# EAGLE design board (EAGLE 7.7.0)
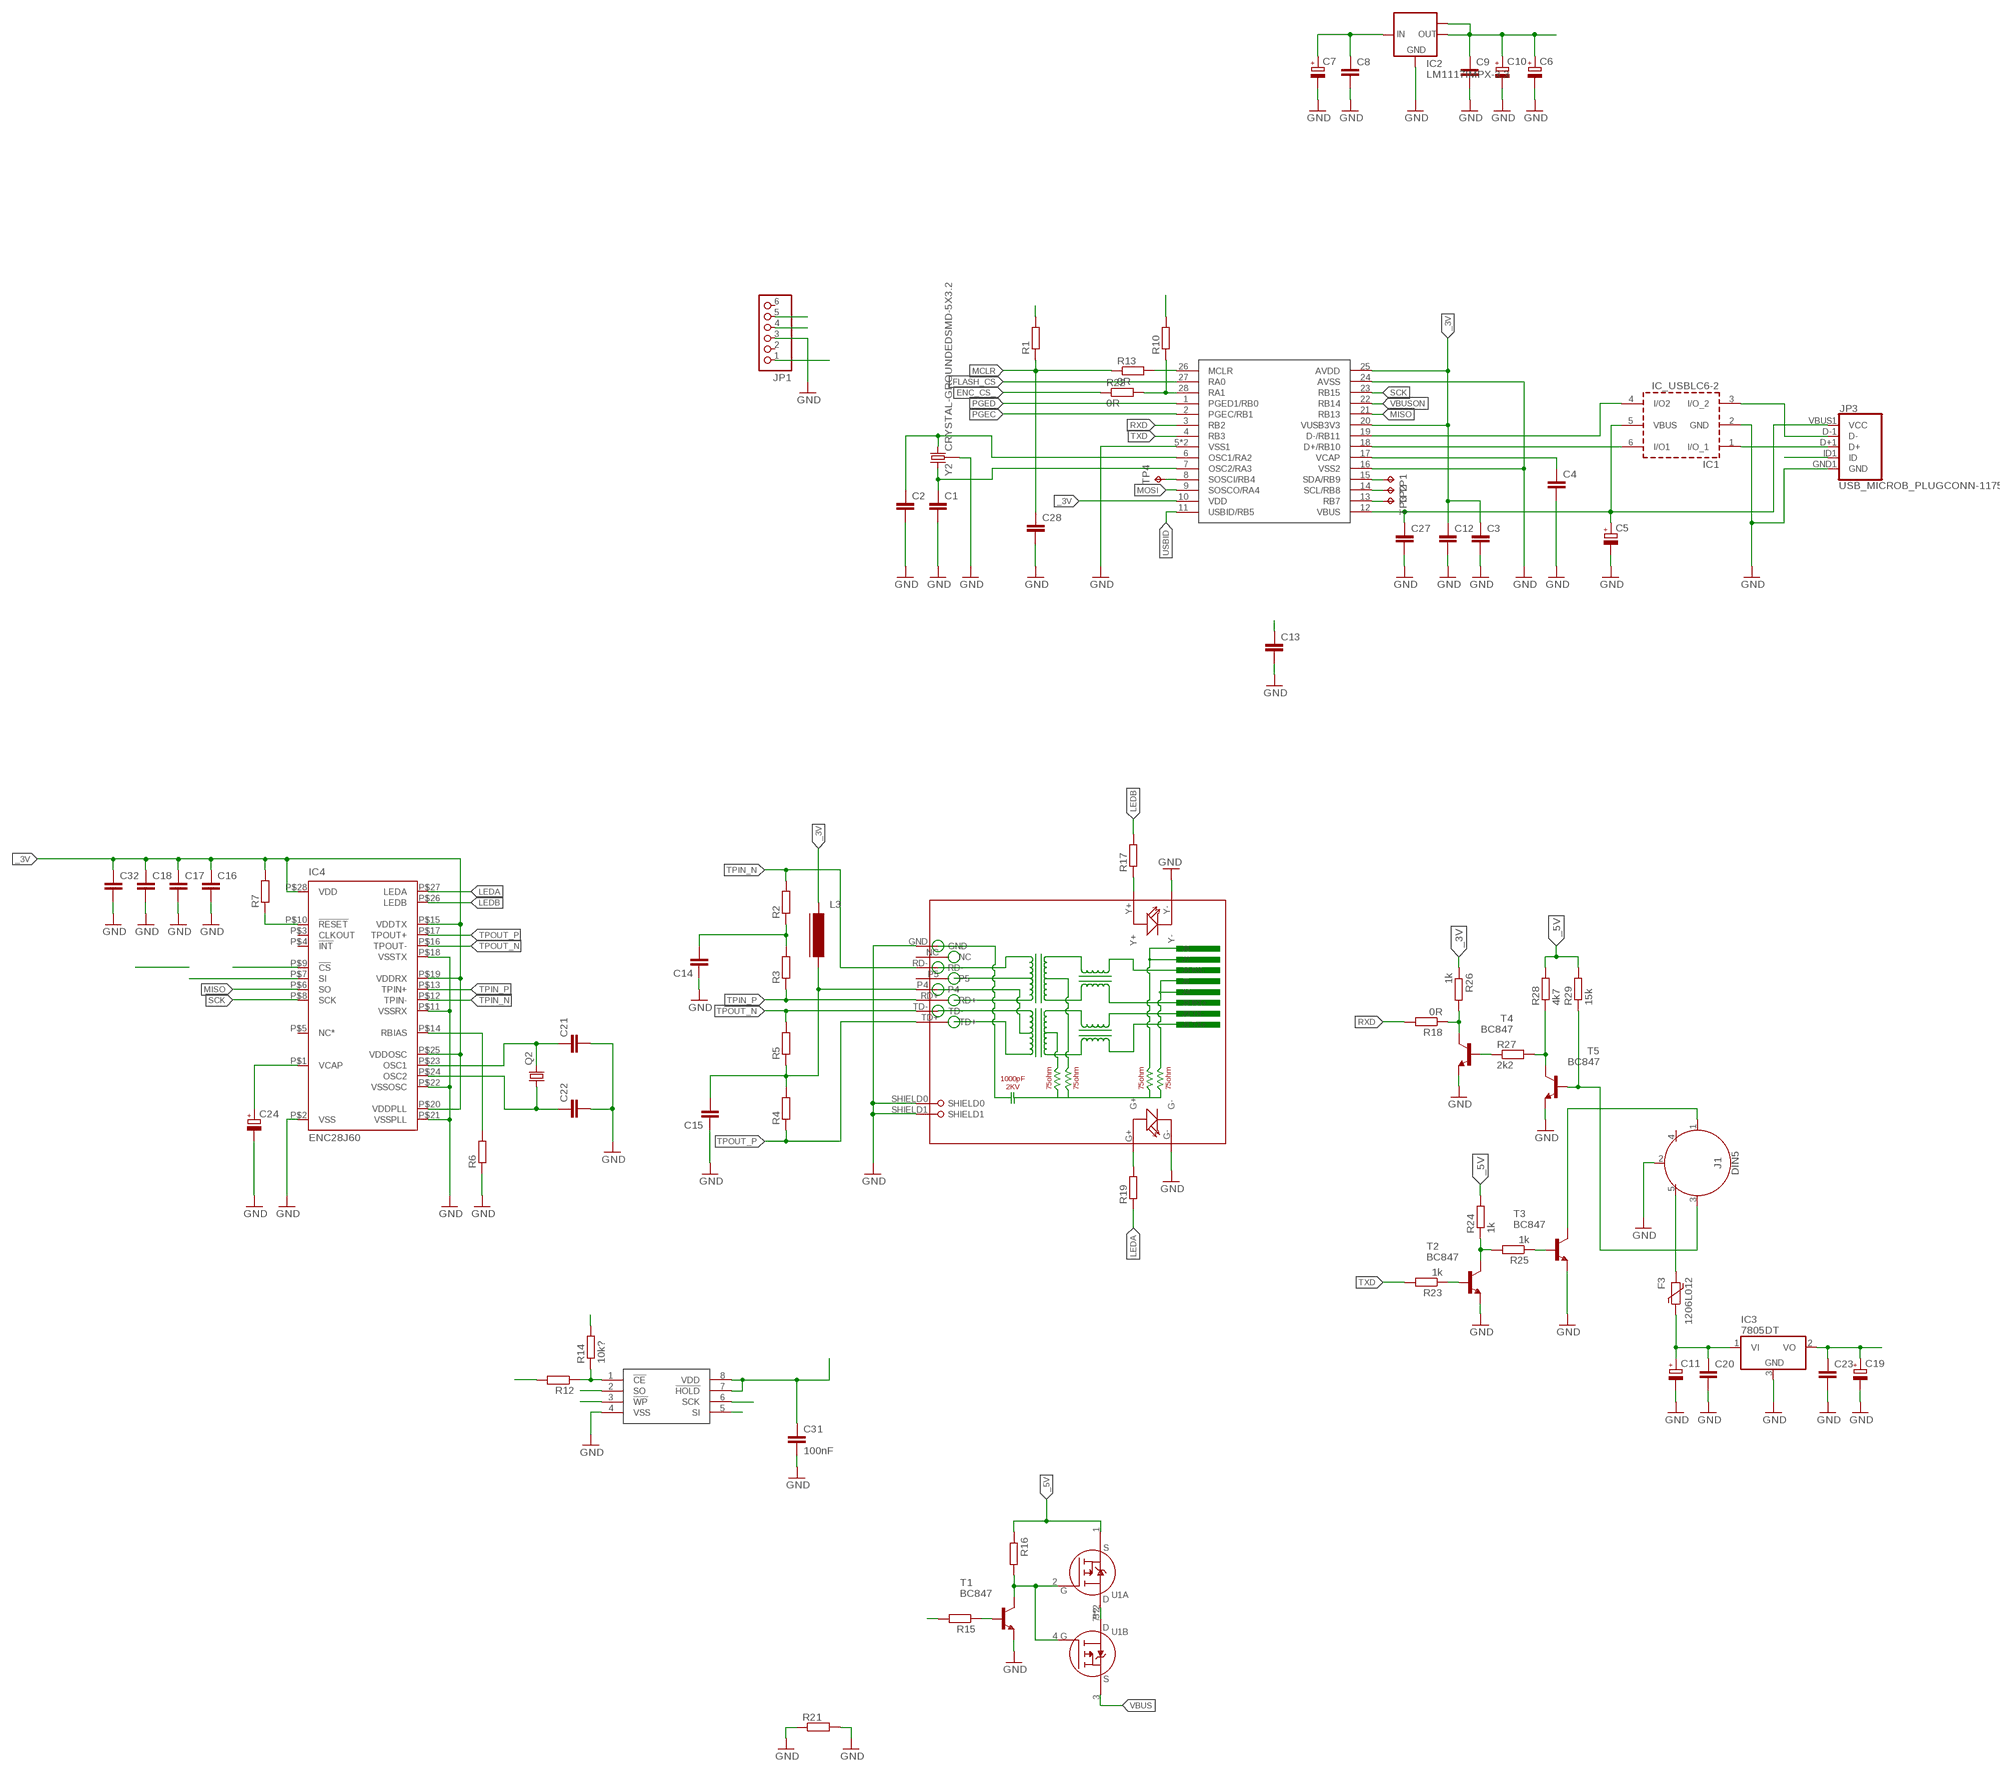
[diagram p0: schematic, sheet 1]

## Parts
C1  C-EUC0603  [C0603]
C2  C-EUC0603  [C0603]
C3  C-EUC0402  [C0402]
C4  C-EUC0603  [C0603]
C5  CPOL-EUSMCA  [SMC_A]
C6  CPOL-EUSMCA  [SMC_A]
C7  CPOL-EUSMCC  [SMC_C]
C8  C-EUC0603  [C0603]
C9  C-EUC0603  [C0603]
C10  CPOL-EUSMCB  [SMC_B]
C11  CPOL-EUSMCC  [SMC_C]
C12  C-EUC0603  [C0603]
C13  C-EUC0603  [C0603]
C14  C-EUC0603  [C0603]
C15  C-EUC0603  [C0603]
C16  C-EUC0402  [C0402]
C17  C-EUC0402  [C0402]
C18  C-EUC0402  [C0402]
C19  CPOL-EUSMCC  [SMC_C]
C20  C-EUC0603  [C0603]
C21  C-EUC0603  [C0603]
C22  C-EUC0603  [C0603]
C23  C-EUC0603  [C0603]
C24  CPOL-EUSMCA  [SMC_A]
C27  C-EUC0603  [C0603]
C28  C-EUC0603  [C0603]
C31  100nF  C-EUC0603  [C0603]
C32  C-EUC0402  [C0402]
F3  1206L012  [1206L]
IC1  IC_USBLC6-2  [SOT-23-6L]
IC2  LM1117IMPX-3.3  [SOT223]
IC3  7805DT  [TO252]
IC4  ENC28J60  [TSSOP28W]
J1  DIN5  [DIN5-RA-PTH]
JP1  PINHD-1X6  [1X06]
JP3  USB_MICROB_PLUGCONN-11752  [USB-B-MICRO-SMD_V03]
L3  FERRITE-0805  [FB805]
Q2  CRYSTALHC49S  [HC49/S]
R1  R-EU_R0603  [R0603]
R2  R-EU_R0603  [R0603]
R3  R-EU_R0603  [R0603]
R4  R-EU_R0603  [R0603]
R5  R-EU_R0603  [R0603]
R6  R-EU_R0805  [R0805]
R7  R-EU_R0603  [R0603]
R10  R-EU_R0603  [R0603]
R12  R-EU_R0603  [R0603]
R13  0R  R-EU_R0603  [R0603]
R14  10k?  R-EU_R0603  [R0603]
R15  R-EU_R0603  [R0603]
R16  R-EU_R0402  [R0402]
R17  R-EU_R1206  [R1206]
R18  0R  R-EU_R1206  [R1206]
R19  R-EU_R1206  [R1206]
R21  R-EU_R1206  [R1206]
R22  0R  R-EU_R0603  [R0603]
R23  1k  R-EU_R1206  [R1206]
R24  1k  R-EU_R0603  [R0603]
R25  1k  R-EU_R0603  [R0603]
R26  1k  R-EU_R0603  [R0603]
R27  2k2  R-EU_R0603  [R0603]
R28  4k7  R-EU_R0603  [R0603]
R29  15k  R-EU_R0603  [R0603]
RJ1  HR911105A  [HR911105A]
T1  BC847  [SOT23]
T2  BC847  [SOT23]
T3  BC847  [SOT23]
T4  BC847  [SOT23]
T5  BC847  [SOT23]
TP1  TPTP16R  [TP16R]
TP2  TPTP16R  [TP16R]
TP3  TPTP16R  [TP16R]
TP4  TPTP16R  [TP16R]
U1  IRF7314_P_MOSFET  [SO-8]
U$1  PIC32MX250F128B  [QFN-S28-6X6]
U$2  SST25VF016BSO8M  [SO-08M]
Y2  CRYSTAL-GROUNDEDSMD-5X3.2  [CRYSTAL-SMD-5X3.2-4PAD]

## Nets
_3V: C3.1 C6.+ C9.1 C10.+ C12.1 C13.1 C16.1 C17.1 C18.1 C31.1 C32.1 IC2.2(OUT) IC2.TAB(OUT1) IC4.P$15(VDDTX) IC4.P$19(VDDRX) IC4.P$20(VDDPLL) IC4.P$25(VDDOSC) IC4.P$28(VDD) L3.1 R1.2 R7.2 R10.2 R14.2 R26.1 U$1.10(VDD) U$1.20(VUSB3V3) U$1.25(AVDD) U$2.3(!WP) U$2.7(!HOLD) U$2.8(VDD)
_5V: C7.+ C8.1 C19.+ C23.1 IC2.3(IN) IC3.2(VO) R16.1 R24.2 R28.2 R29.2 U1.1(A:S)
D_N: IC1.4(I/O2) U$1.19(D-/RB11)
D_P: IC1.6(I/O1) U$1.18(D+/RB10)
ENC_CS_: IC4.P$9(!CS) R22.1
ENC_RST: IC4.P$10(!RESET) R7.1
FLASH_CS: R12.2 U$1.27(RA0)
GND: C1.2 C2.2 C3.2 C4.2 C5.- C6.- C7.- C8.2 C9.2 C10.- C11.- C12.2 C13.2 C14.1 C15.1 C16.2 C17.2 C18.2 C19.- C20.2 C21.2 C22.2 C23.2 C24.- C27.2 C28.2 C31.2 C32.2 IC1.2(GND) IC2.1(GND) IC3.3(GND) IC4.P$2(VSS) IC4.P$11(VSSRX) IC4.P$18(VSSTX) IC4.P$21(VSSPLL) IC4.P$22(VSSOSC) J1.2 JP1.3 JP3.GND1(GND) R6.1 R21.1 R21.2 RJ1.G- RJ1.GND RJ1.SHIELD0 RJ1.SHIELD1 RJ1.Y- T1.2(E) T2.2(E) T3.2(E) T4.2(E) T5.2(E) U$1.5(VSS1) U$1.16(VSS2) U$1.24(AVSS) U$1.EXP(VSS1) U$2.4(VSS) Y2.2 Y2.4
IO_INT: TP3.TP U$1.13(RB7)
LEDA: IC4.P$27(LEDA) R19.1
LEDB: IC4.P$26(LEDB) R17.2
MCLR: C28.1 JP1.1 R1.1 R13.1
MCLR_: R13.2 U$1.26(MCLR)
MISO: IC4.P$6(SO) U$1.21(RB13) U$2.2(SO)
MOSI: IC4.P$7(SI) U$1.9(SOSCO/RA4) U$2.5(SI)
N$1: R15.1 T1.1(B)
N$2: C14.2 R2.1 R3.2
N$3: J1.1 T3.3(C)
N$4: C1.1 U$1.7(OSC2/RA3) Y2.3
N$5: C2.1 U$1.6(OSC1/RA2) Y2.1
N$6: C15.2 L3.2 R4.2 R5.1 RJ1.P4
N$7: C4.1 U$1.17(VCAP)
N$8: F3.2 J1.5
N$9: IC1.1(I/O_1) JP3.D+1(D+)
N$10: IC1.3(I/O_2) JP3.D-1(D-)
N$11: R12.1 R14.1 U$2.1(!CE)
N$12: IC4.P$14(RBIAS) R6.2
N$13: R16.2 T1.3(C) U1.2(A:G) U1.4(B:G)
N$19: R10.1 R22.2 U$1.28(RA1)
N$20: U1.5(B:D) U1.6(B:D) U1.7(A:D) U1.8(A:D)
N$21: R23.1 T2.1(B)
N$22: C21.1 IC4.P$23(OSC1) Q2.2
N$23: C22.1 IC4.P$24(OSC2) Q2.1
N$24: R24.1 R25.2 T2.3(C)
N$25: R25.1 T3.1(B)
N$26: R27.1 T4.1(B)
N$27: R18.1 R26.2 T4.3(C)
N$28: R27.2 R28.1 T5.3(C)
N$29: C24.+ IC4.P$1(VCAP)
N$30: R17.1 RJ1.Y+
N$31: R19.2 RJ1.G+
N$32: J1.3 R29.1 T5.1(B)
N$33: C11.+ C20.1 F3.1 IC3.1(VI)
PGEC: JP1.5 U$1.2(PGEC/RB1)
PGED: JP1.4 U$1.1(PGED1/RB0)
RX: TP2.TP U$1.14(SCL/RB8)
RXD: R18.2 U$1.3(RB2)
SCK: IC4.P$8(SCK) U$1.23(RB15) U$2.6(SCK)
SIG: TP4.TP U$1.8(SOSCI/RB4)
TPIN_N: IC4.P$12(TPIN-) R2.2 RJ1.RD-
TPIN_P: IC4.P$13(TPIN+) R3.1 RJ1.RD+
TPOUT_N: IC4.P$16(TPOUT-) R5.2 RJ1.TD-
TPOUT_P: IC4.P$17(TPOUT+) R4.1 RJ1.TD+
TX: TP1.TP U$1.15(SDA/RB9)
TXD: R23.2 U$1.4(RB3)
USBID: JP3.ID1(ID) U$1.11(USBID/RB5)
VBUS: C5.+ C27.1 IC1.5(VBUS) JP3.VBUS1(VCC) U1.3(B:S) U$1.12(VBUS)
VBUSON: R15.2 U$1.22(RB14)
Unconnected: IC4.P$3(CLKOUT) IC4.P$4(!INT) IC4.P$5(NC*) J1.4 JP1.2 JP1.6 RJ1.NC RJ1.P5

## Library data of the parts
C1-C4 C8 C9 C12-C18 C20-C23 C27 C28 C31 C32 = rcl:C-EU: CAPACITOR, European symbol
C5-C7 C10 C11 C19 C24 = rcl:CPOL-EU: POLARIZED CAPACITOR, European symbol
F3 = polyfuse-smd_10:?: Polyfuse Resettable PTC Source: http://www.littelfuse.com/products/resettable-ptcs.aspx; MF: Littelfuse; MPN: 1206L012; OC_FARNELL: 1596988; OC_NEWARK: 05M2298
IC1 = dp_devices:IC_USBLC6-2
IC2 = lm1117:LM1117IMPX-*
IC3 = linear:78*: Positive VOLTAGE REGULATOR Source: http://cache.national.com/ds/LM/LM78L05.pdf http://www.fairchildsemi.com/ds/LM/LM7805.pdf
IC4 = microchip:ENC28J60: Stand-Alone Ethernet Controller with SPI Interface Source: http://ww1.microchip.com/downloads/en/DeviceDoc/39662c.pdf
J1 = SparkFun-Connectors:DIN5: DIN5 Connector - Female Right Angle (frequently used as a MIDI Jack connector) This type of connector and cable is frequently used for transmitting midi data (musical instrument digital interface). It is what you usually see on a keyboard or set of electronic drums. Learn more here <https://en.wikipedia.org/wiki/MIDI>. For more information on the pinout and electrical specifications of MIDI communications, please see the following resource: https://www.midi.org/specifications/item/midi-din-electrical-specification Here is the connector we sell at SparkFun: MIDI Connector - Female Right Angle <https://www.sparkfun.com/products/9536> (PRT-09536) Datasheet <hhttp://www.sparkfun.com/datasheets/Prototyping/Connectors/MIDI-RA.pdf> It is used on this SparkFun product: SparkFun MIDI Shield <https://www.sparkfun.com/products/12898> (DEV-12898); PROD_ID: CONN-09481
JP1 = pinhead:PINHD-1X6: PIN HEADER
JP3 = SparkFun-Connectors:USB_MICROB_PLUG: USB Micro-B connectors Some male, some female. Watch your step!; PROD_ID: CONN-11752
L3 = dp_devices:FERRITE: Ferrite bead in various packages
Q2 = crystal:CRYSTAL: CRYSTAL; OC_FARNELL: 1667008; OC_NEWARK: unknown
R1-R7 R10 R12-R19 R21-R29 = rcl:R-EU_: RESISTOR, European symbol
RJ1 = hanrun:HR911105A
T1-T5 = transistor:BC847: NPN TRANSISTOR
TP1-TP4 = testpad:TP: Test pad
U1 = ihpcb-mosfet:IRF7314_P_MOSFET: P-channel MOSFET IRF7314 SO-8 package
U$1 = microchip-pic32mx_mod:PIC32MX250F128B
U$2 = mw:SST25VF016B
Y2 = SparkFun-Clocks:CRYSTAL-GROUNDED: Crystals w/ Ground Pin (Generic) These are passive quartz crystals, which can be used as a clock source for a microcontroller. Crystal's are usually two-terminal devices. A third terminal may be optionally connected to ground, as recommended by the manufaturer.

## Board
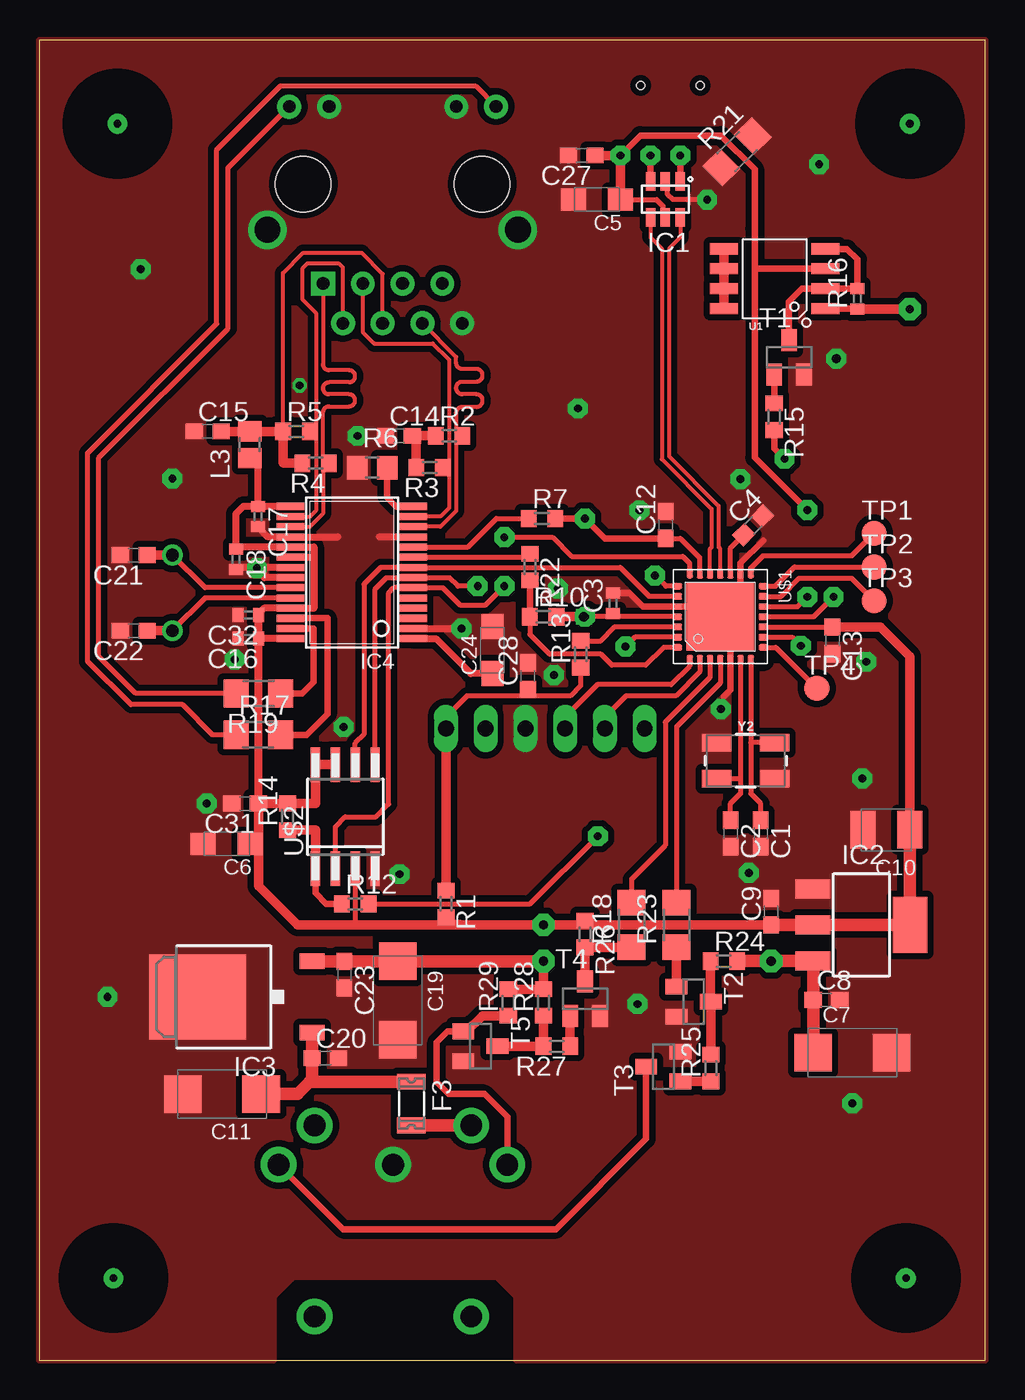
[diagram p1: board, top side]
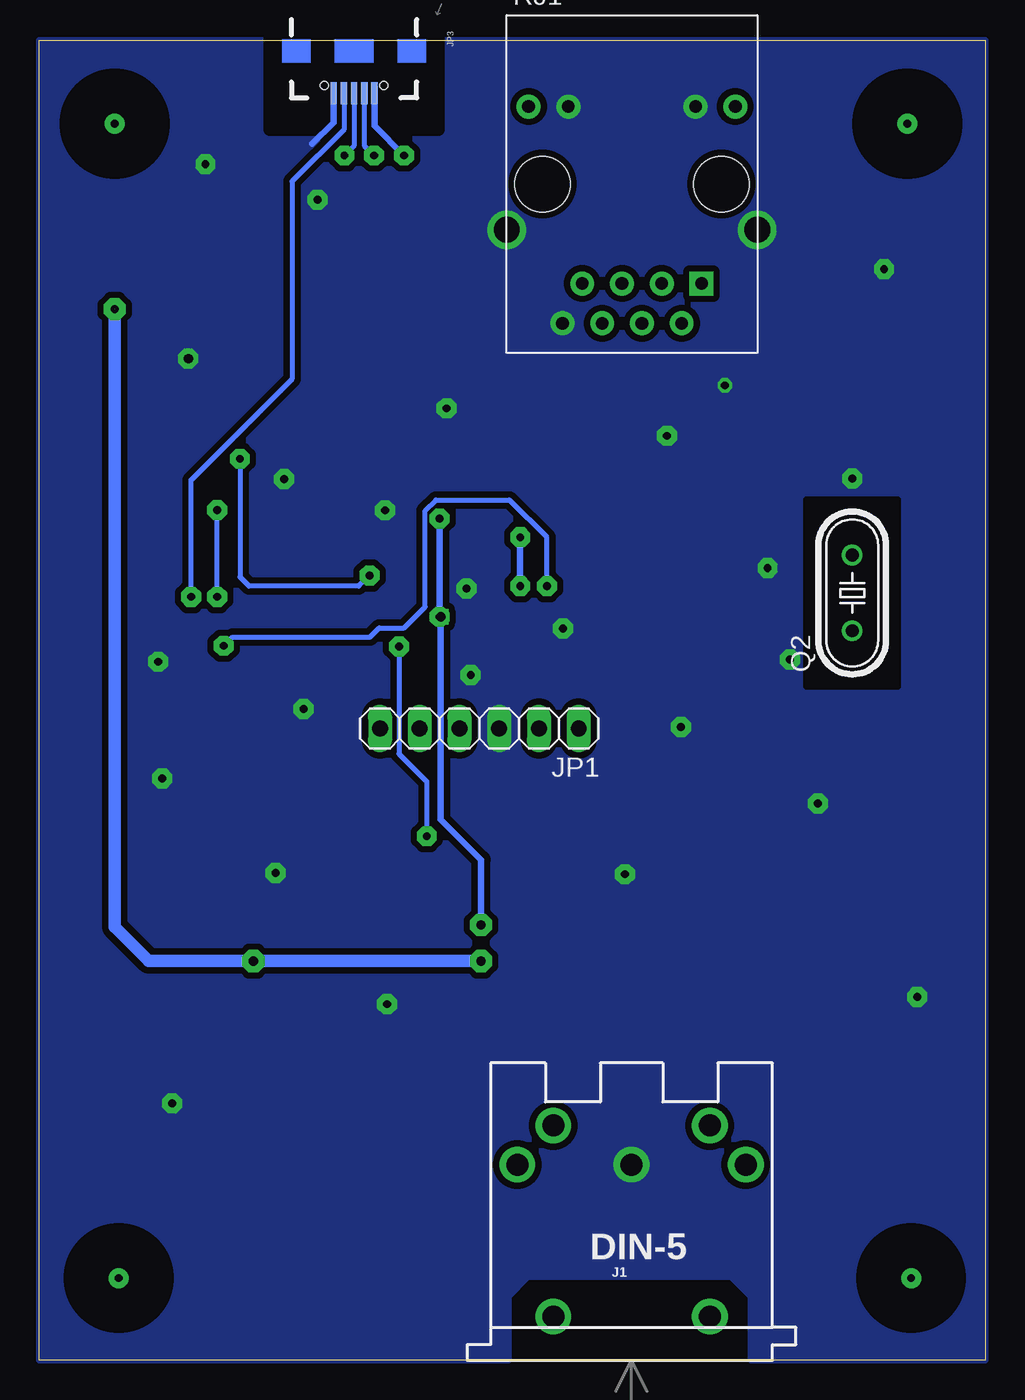
[diagram p2: board, bottom side, seen from below]

Size 60.45 x 84.33 mm. Coordinates in mm from the lower left corner, seen from the top.
Outline: 0,0 60.45,0 60.45,84.33 0,84.33 0,0
Copper layers (1*16): Top 0.035mm / dielectric 1.5mm / Bottom 0.035mm
Design rules "default *": minimum track width 10mil, minimum drill 24mil, track to track 8mil, track to pad 8mil, pad to pad 8mil, via to via 8mil, smd to smd 8mil, copper to edge 0mil, drill to drill 8mil, minimum pad ring 10mil, minimum via ring 8mil, stop-mask expansion 4mil, vias tented up to drill 0mil, thermal gap 10mil
tRestrict: area 39.7,74.9 to 40.3,75.9; area 15.1,45.9 to 16.9,54.8; area 23,45.9 to 24.8,54.8; area 40.7,44.7 to 46.4,50.3; area 2.2,76.2 to 7.8,81.8; area 52.8,76.2 to 58.4,81.8; area 2,2.5 to 7.5,8; area 52.6,2.5 to 58.2,8
bRestrict: area 34.9,78.6 to 45.7,84.3; area 2.2,76.2 to 7.8,81.8; area 52.8,76.2 to 58.4,81.8; area 2,2.5 to 7.5,8; area 52.6,2.5 to 58.2,8

### Footprints (pad centres in the part's own frame; a part is rotated, then mirrored left to right if it is on the bottom)
C0603 = smd 1.1 x 1: 1 -0.85,0; 2 0.85,0
C0402 = smd 0.7 x 0.9: 1 -0.65,0; 2 0.65,0
SMC_A = smd 1.6 x 1.4: + -1.5,0; - 1.5,0
SMC_C = smd 2.4 x 2.4: + -2.5,0; - 2.5,0
SMC_B = smd 1.6 x 2.4: + -1.5,0; - 1.5,0
1206L = smd 1 x 1.8: 1 -1.4,0; 2 1.4,0
SOT-23-6L = smd 0.6 x 1.2: 1 -0.95,-2.3; 2 0,-2.3; 3 0.95,-2.3; 4 0.95,0; 5 0,0; 6 -0.95,0
SOT223 = smd 1.219 x 2.235: 1 -2.311,-3.099; 2 0,-3.099; 3 2.311,-3.099 | smd 3.6 x 2.2: TAB 0,3.099
TO252 = smd 1 x 1.6: 1 -2.28,-4.8; 2 2.28,-4.8 | smd 5.4 x 6.2: 3 0,2.5
TSSOP28W = smd 0.45 x 1.75: P$1 0,-0.65; P$2 0.65,-0.65; P$3 1.3,-0.65; P$4 1.95,-0.65; P$5 2.6,-0.65; P$6 3.25,-0.65; P$7 3.9,-0.65; P$8 4.55,-0.65; P$9 5.2,-0.65; P$10 5.85,-0.65; P$11 6.5,-0.65; P$12 7.15,-0.65; P$13 7.8,-0.65; P$14 8.45,-0.65; P$15 8.45,7.2; P$16 7.8,7.2; P$17 7.15,7.2; P$18 6.5,7.2; P$19 5.85,7.2; P$20 5.2,7.2; P$21 4.55,7.2; P$22 3.9,7.2; P$23 3.25,7.2; P$24 2.6,7.2; P$25 1.95,7.2; P$26 1.3,7.2; P$27 0.65,7.2; P$28 0,7.2
DIN5-RA-PTH = drill 1.4 pad 2.286: 1 7.3,12.5; 2 0,12.5; 3 -7.3,12.5; 4 5,15; 5 -5,15; 6 -5,2.8; 7 5,2.8
1X06 = drill 1.016 long: 1 -6.35,0; 2 -3.81,0; 3 -1.27,0; 4 1.27,0; 5 3.81,0; 6 6.35,0
USB-B-MICRO-SMD_V03 = smd 1.4 x 0.4: D+1 2.7,0; D-1 2.7,0.65; GND1 2.7,-1.3; ID1 2.7,-0.65; VBUS1 2.7,1.3 | hole 0.5: 2.2,1.9; 2.2,-1.9
FB805 = smd 1.3 x 1.5: 1 -0.85,0; 2 0.85,0
HC49/S = drill 0.813: 1 -2.413,0; 2 2.413,0
R0603 = smd 1 x 1.1: 1 -0.85,0; 2 0.85,0
R0805 = smd 1.3 x 1.5: 1 -0.95,0; 2 0.95,0
R0402 = smd 0.7 x 0.9: 1 -0.65,0; 2 0.65,0
R1206 = smd 1.6 x 1.803: 1 -1.422,0; 2 1.422,0
HR911105A = drill 0.813 pad 1.524: G+ 4.953,-6.604; G- 4.953,-4.064; GND -8.89,4.445; NC -6.35,3.175; P4 -8.89,-0.635; P5 -6.35,0.635; RD+ -6.35,-1.905; RD- -8.89,1.905; TD- -8.89,-3.175; Y+ 4.953,6.604; Y- 4.953,4.064 | drill 1.651 pad 2.159: SHIELD0 -2.921,8.001; SHIELD1 -2.921,-8.001 | drill 0.813 pad 1.524 square: TD+ -6.35,-4.445 | hole 3.556: 0,-5.715; 0,5.715
SOT23 = smd 1 x 1.4: 1 -0.95,-1.1; 2 0.95,-1.1; 3 0,1.1
TP16R = smd 1.6 x 1.6: TP 0,0
SO-8 = smd 0.711 x 1.778: 1 -1.905,-3.239; 2 -0.635,-3.239; 3 0.635,-3.239; 4 1.905,-3.239; 5 1.905,3.239; 6 0.635,3.239; 7 -0.635,3.239; 8 -1.905,3.239
QFN-S28-6X6 = smd 0.6 x 0.4: 1 2.75,-1.95; 2 2.75,-1.3; 3 2.75,-0.65; 4 2.75,0; 5 2.75,0.65; 6 2.75,1.3; 7 2.75,1.95; 15 -2.75,1.95; 16 -2.75,1.3; 17 -2.75,0.65; 18 -2.75,0; 19 -2.75,-0.65; 20 -2.75,-1.3; 21 -2.75,-1.95 | smd 0.4 x 0.6: 8 1.95,2.75; 9 1.3,2.75; 10 0.65,2.75; 11 0,2.75; 12 -0.65,2.75; 13 -1.3,2.75; 14 -1.95,2.75; 22 -1.95,-2.75; 23 -1.3,-2.75; 24 -0.65,-2.75; 25 0,-2.75; 26 0.65,-2.75; 27 1.3,-2.75; 28 1.95,-2.75 | smd 4.3 x 4.3: EXP 0,0
SO-08M = smd 0.6 x 2.2: 1 -1.905,-3.33; 2 -0.635,-3.33; 3 0.635,-3.33; 4 1.905,-3.33; 5 1.905,3.33; 6 0.635,3.33; 7 -0.635,3.33; 8 -1.905,3.33
CRYSTAL-SMD-5X3.2-4PAD = smd 1.9 x 1.1: 1 -1.85,-1.15; 2 1.85,-1.15; 3 1.85,1.15; 4 -1.85,1.15

### Placement (x,y rotation side)
C1  46.1,33.66 270 top
C2  44.18,33.66 270 top
C3  36.65,48.35 90 top
C4  45.61,53.34 45 top
C5  35.64,74.14 180 top
C6  11.99,32.99 180 top
C7  51.95,19.65 0 top
C8  50.29,23.02 0 top
C9  46.76,28.66 90 top
C10  54.12,33.89 180 top
C11  11.68,17.02 180 top
C12  40.02,53.36 90 top
C13  50.67,45.99 270 top
C14  22.99,59.05 0 top
C15  10.77,59.33 0 top
C16  13.36,46.1 180 top
C17  13.98,53.9 270 top
C18  12.58,51.18 270 top
C19  22.91,22.99 270 top
C20  18.29,19.3 0 top
C21  6.05,51.44 180 top
C22  6.05,46.61 180 top
C23  19.51,24.64 270 top
C24  28.96,45.36 90 top
C27  34.66,76.96 180 top
C28  31.22,43.7 90 top
C31  13.16,35.57 180 top
C32  13.36,47.6 180 top
F3  23.78,16.41 270 top
IC1  40.01,73 180 top
IC2  52.53,27.81 270 top
IC3  12.62,23.22 90 top
IC4  23.24,46.1 90 top
J1  22.61,0 0 bottom
JP1  32.33,40.36 180 bottom
JP3  40.34,83.64 270 bottom
L3  13.46,58.48 90 top
Q2  8.51,49.02 90 bottom
R1  25.99,29.16 270 top
R2  26.19,59.05 0 top
R3  24.94,57.02 180 top
R4  17.67,57.3 180 top
R5  16.43,59.33 0 top
R6  21.29,57.02 0 top
R7  32.12,53.77 0 top
R10  32.2,47.5 0 top
R12  20.19,29.16 0 top
R13  34.59,45.11 90 top
R14  15.88,34.72 90 top
R15  46.95,60.27 270 top
R16  52.27,67.79 90 top
R17  14.01,39.95 0 top
R18  37.85,27.81 90 top
R19  14.01,42.6 180 top
R21  44.59,77.2 45 top
R22  31.35,50.67 270 top
R23  40.72,27.81 90 top
R24  43.74,25.5 0 top
R25  42.91,18.67 90 top
R26  34.87,27.23 270 top
R27  33.07,20.07 180 top
R28  32.22,22.86 90 top
R29  29.97,22.86 90 top
RJ1  22.58,75.13 90 bottom
T1  47.9,64.06 0 top
T2  41.81,22.91 270 top
T3  39.88,18.77 90 top
T4  34.87,23.11 0 top
T5  28.19,20.07 270 top
TP1  53.34,52.83 0 top
TP2  53.34,50.67 0 top
TP3  53.34,48.51 0 top
TP4  49.68,42.93 0 top
U1  46.99,69.09 90 top
U$1  43.51,47.5 270 top
U$2  19.56,34.72 0 top
Y2  45.14,38.3 0 top

### Tracks (layer width: path | path; a pad name or v marks a point on that pad's centre or on a via)
_3V  (via drill 0.5 pad 1.27, 0.6, 0.6 pad 1.42)
  Top 0.305: U$1.20 42.21,51.26 40.96,52.51 C12.1 40.02,52.37 | U$1.25 36.83,47.5 | 36.83,47.5 v34.87,47.5 | C3.1 36.65,47.68 36.83,47.5 | U$2.3 20.19,27.81 | U$1.10 50.55,46.85 50.56,46.84 C13.1
  Top 0.406: C6.+ 13.91,33 14.01,32.89 | C12.1 36.14,52.51 v34.87,53.77 34.59,53.77 R7.2
  Top 0.457: IC4.P$20 17.55,51.3 | 17.55,51.3 17.55,48.05 IC4.P$25 14.37,48.05 14.01,47.69 C32.1 | IC4.P$28 C16.1 | 17.55,51.3 17.55,51.95 IC4.P$19 12.58,51.95 C18.1 12.58,54.09 13.04,54.55 C17.1 | IC4.P$15 C17.1 | C17.1 13.98,57.16 13.93,57.16 L3.1
  Top 0.508: C32.1 C16.1 C31.1
  Top 0.61: U$2.7 U$2.8 17.65,35.57 R14.2 C31.1 14.01,32.89 14.01,30.32 16.51,27.81 20.19,27.81 27.94,27.81 | R10.2 v34.8,47.5 v34.87,47.5 | 34.8,27.81 v32.22,27.81 27.94,27.81 | 34.8,27.81 46.74,27.81 C9.1 | R1.2 25.98,27.86 27.94,27.81 | R26.1 34.87,27.89 34.8,27.81 | C10.+ 55.62,44.96 | 55.62,44.96 55.63,44.96 | C13.1 53.74,46.84 55.62,44.96
  Top 0.813: 46.74,27.81 IC2.2 IC2.TAB C10.+
  Bottom 0.406: v34.87,53.77 v34.87,47.5 | v34.8,47.5 34.8,34.54 32.22,31.97 v32.22,27.81
_5V  (via drill 0.5 pad 1.42, 0.6 pad 1.42)  (1 unrouted)
  Top 0.406: U1.1 52.23,67.18 R16.1 | C23.1 19.31,25.49 19.3,25.5 | C8.1 49.44,23.23 49.45,23.24
  Top 0.61: v32.22,25.5 R28.2 R29.2 | R16.1 v55.62,67.14
  Top 0.813: IC3.2 19.3,25.5 23.11,25.5 | 23.11,25.5 v32.21,25.5 v32.22,25.5 | C19.+ 23.11,25.49 23.11,25.5 | R24.2 v46.76,25.5 IC2.3 49.45,25.48 49.45,23.24 C7.+
  Bottom 0.61: v55.63,67.14 55.62,64.1
  Bottom 0.813: v55.63,67.14 55.63,27.69 53.44,25.5 v46.76,25.5 v32.22,25.5
D_N
  Top 0.254: IC1.4 39.05,71.73 39.78,71.01 39.78,57.56 42.95,54.39 42.95,51.94 42.86,51.85 U$1.19
D_P
  Top 0.254: IC1.6 40.95,71.73 40.23,71.01 40.23,57.75 43.41,54.58 43.41,51.94 43.51,51.84 U$1.18
ENC_CS_
  Top 0.305: IC4.P$9 31.13,51.3 R22.1
ENC_RST
  Top 0.305: IC4.P$10 27.39,51.95 29.21,53.77 R7.1
FLASH_CS  (via drill 0.5 pad 1.27)
  Top 0.305: U$1.27 38.07,46.2 v37.47,45.59 | R12.2 31.37,29.16 v35.69,33.48
  Bottom 0.305: v37.47,45.59 37.47,38.73 35.69,36.96 v35.69,33.48
GND  (via drill 0.5, 0.5 pad 1.27, 0.6 pad 1.27)
  Top 0.305: v42.67,74.14 40.48,74.14 40.15,74.47 40.15,75.21 40.09,75.21 IC1.2
  Top 0.401: C3.2 37.72,49 38.57,48.15 U$1.24 42.86,48.15 U$1.EXP | U$1.EXP 44.81,48.8 U$1.16 44.81,50.93 46.25,52.38 | U$1.EXP 44.16,46.85 U$1.5 44.16,42.81 43.74,42.39
  Top 0.457: IC4.P$11 21.75,52.6 | 19.08,52.6 IC4.P$18 14.61,52.6 13.98,53.23 C17.2 | IC4.P$2 v26.99,46.75 | IC4.P$21 14.38,50.65 | 14.38,50.65 12.58,50.65 C18.2 | IC4.P$22 14.38,50 14.38,50.65
  Bottom 0.406: JP3.GND1 41.63,79.07 43,77.7
  other vias: 38.35,54.3 44.81,56.29 16.64,62.28 19.45,40.46 13.91,50.62 12.49,44.77 43.56,41.61 51.95,16.41 8.51,56.33 20.34,59.05 23.03,31.06 10.71,35.57 52.85,44.63 33.15,49.29 52.58,37.16 6.48,69.7 34.42,60.81 50.93,63.98 49.83,76.4 45.34,31.14 38.23,22.76 4.36,23.22 32.88,43.77
  pour Top (isolate 0.406, rank 2, no thermals): 0,84.33 0,0 14.99,0 14.99,4.06 16.26,5.33 29.21,5.33 30.48,4.06 30.48,0 60.45,0 60.45,84.33
  pour Bottom (isolate 0.406, no thermals): 0,84.33 0,0 14.99,0 14.99,4.06 16.26,5.33 29.21,5.33 30.48,4.06 30.48,0 60.45,0 60.45,84.33
IO_INT
  Top 0.305: U$1.13 47.4,48.8 48.56,49.96 51.89,49.96 TP3.TP
LEDA
  Top 0.406: IC4.P$27 17.53,46.75 17.53,43.33 16.79,42.6 R19.1
LEDB
  Top 0.406: IC4.P$26 18.41,47.4 18.41,41.28 17.09,39.95 R17.2
MCLR
  Top 0.305: 31.11,42.44 33.93,42.44 34.59,43.1 R13.1 | 31.11,42.44 27.33,42.44 25.98,41.1 JP1.1 | C28.1 31.23,42.55 31.11,42.44
  Top 0.61: JP1.1 R1.1
MCLR_
  Top 0.305: U$1.26 36.76,46.85 35.88,45.96 R13.2
MISO  (via drill 0.5 pad 1.27)
  Top 0.305: U$2.2 18.92,34.09 19.56,34.72 21.51,34.72 22.33,35.54 22.33,49.02 22.66,49.35 IC4.P$6 25.78,49.35 26.87,48.26 28.53,48.26 v29.72,49.45 | v29.72,52.58 32.79,52.58 34.01,51.36 41.12,51.36 41.55,50.93 U$1.21
  Bottom 0.406: v29.72,52.58 v29.72,49.45
MOSI  (via drill 0.5 pad 1.27)
  Top 0.305: U$2.5 21.46,49.28 22.19,50 IC4.P$7 26.2,50 26.75,49.45 v28.02,49.45 | U$1.9 48.11,46.2 v48.67,45.64
  Bottom 0.305: v48.67,45.64 48.1,46.2 39.32,46.2 38.73,46.79 37.13,46.79 35.79,48.13 35.79,54.28 35.1,54.97 30.4,54.97 28.02,52.58 v28.02,49.45
N$1
  Top 0.406: R15.1 T1.1
N$2
  Top 0.61: R3.2 24.09,58.88 24.02,58.88 C14.2 R2.1
N$3
  Top 0.406: T3.3 38.78,14.14 33.02,8.38 19.42,8.38 J1.1
N$4
  Top 0.305: U$1.7 45.46,39.45 | 45.46,39.45 45.46,36.2 46.09,35.57 C1.1 | Y2.3 45.46,39.45
N$5
  Top 0.305: U$1.6 44.81,37.15 | 44.81,37.15 44.81,36.2 44.17,35.57 C2.1 | Y2.1 44.81,37.15
N$6
  Top 0.254: RJ1.P4 21.95,69.39 20.6,70.74 16.87,70.74 15.58,69.46 R5.1
  Top 0.61: R4.2 15.62,57.3 15.58,57.34 R5.1 L3.2 C15.2
N$7
  Top 0.305: U$1.17 44.16,51.89 C4.1
N$8
  Top 0.813: J1.5 F3.2
N$9  (via drill 0.5 pad 1.27)
  Top 0.406: IC1.1 v40.95,76.96
  Bottom 0.305: JP3.D+1 40.34,77.58 v40.95,76.96
N$10  (via drill 0.5 pad 1.27)
  Top 0.406: IC1.3 v39.05,76.96
  Bottom 0.305: JP3.D-1 39.69,77.59 v39.05,76.96
N$11
  Top 0.406: R12.1 18.34,29.16 17.65,29.84 U$2.1
  Top 0.61: R14.1 17.65,33.87 U$2.1
N$12
  Top 0.406: IC4.P$14 22.79,54.55 22.23,55.11 R6.2
N$13
  Top 0.406: T1.3 47.9,67.64 48.72,68.45 U1.2 R16.2 52.27,70.33 51.61,70.99 U1.4
N$14
  cutout Bottom: 5.59,54.99 5.59,43.05 11.43,43.05 11.43,54.99
N$15  (via drill 0.5 pad 1.27)
  other vias: 5,79
N$16  (via drill 0.5 pad 1.27)
  other vias: 4.75,5.25
N$17  (via drill 0.5 pad 1.27)
  other vias: 55.38,5.25
N$18  (via drill 0.5 pad 1.27)
  other vias: 55.63,79
N$19
  Top 0.305: U$1.28 39.88,45.55 38.73,44.4 36.59,44.4 35.88,45.11 32.61,45.11 31.35,46.37 R10.1
  Top 0.406: R22.2 R10.1
N$20
  Top 0.61: U1.5 U1.6 U1.7 U1.8
N$21
  Top 0.61: R23.1 40.72,24.12 T2.1
N$22
  Top 0.305: IC4.P$23 10.59,49.35 Q2.2
  Top 0.61: C21.1 Q2.2
N$23
  Top 0.305: IC4.P$24 10.6,48.7 Q2.1
  Top 0.61: C22.1 Q2.1
N$24
  Top 0.61: R24.1 42.89,23.18 T2.3 R25.2
N$25
  Top 0.61: T3.1 42.89,17.82 R25.1
N$26
  Top 0.61: T4.1 R27.1
N$27
  Top 0.61: R18.1 37.83,26.38 R26.2 T4.3
N$28
  Top 0.61: R28.1 R27.2 T5.3
N$29
  Top 0.457: IC4.P$1 25.35,46.1 27.59,43.86 C24.+
N$30
  Top 0.305: R17.1 11.1,39.95 9.17,41.89 5.87,41.89 3.1,44.65 3.1,57.96 11.35,66.22 11.35,77.34 15.42,81.41 27.86,81.41 RJ1.Y+
N$31
  Top 0.305: R19.2 6.17,42.6 3.81,44.96 3.81,57.66 12.06,65.91 12.06,76.17 RJ1.G+
N$32
  Top 0.406: T5.1 26.1,21.02 25.4,20.32 25.4,17.78 26.16,17.02 28.45,17.02 29.91,15.56 J1.3
  Top 0.61: R29.1 28.31,22.01 27.32,21.02 T5.1
N$33
  Top 0.406: C20.1 17.42,19.3
  Top 0.813: F3.1 23.75,17.78 17.27,17.78 | C11.+ 16.51,17.02 17.27,17.78 | 17.27,17.78 17.42,17.93 17.42,19.3 IC3.1
N$34
  cutout Top: 22.47,16.89 22.47,14.99 24.77,14.99 24.77,16.89
PGEC
  Top 0.305: U$1.2 42.21,43.99 40.66,42.44 37.49,42.44 36.14,41.1 JP1.5
PGED
  Top 0.305: U$1.1 41.56,44.35 40.36,43.16 35.66,43.16 33.6,41.1 JP1.4
RX
  Top 0.305: U$1.14 47.03,49.45 48.26,50.67 TP2.TP
RXD
  Top 0.305: U$1.3 42.86,43.62 40.01,40.77 40.01,32.89 37.85,30.73 R18.2
SCK
  Top 0.305: U$2.6 20.19,39.42 20.75,39.98 20.75,49.58 21.82,50.65 IC4.P$8 37.13,50.65 38.98,48.8 U$1.23
SIG
  Top 0.305: U$1.8 47.06,45.55 TP4.TP
TPIN_N
  Top 0.254: IC4.P$12 25.63,53.25 26.64,54.26 26.64,59.08 | RJ1.RD- 26.64,64.08 26.64,63.7 arc90 27.03,63.32 27.94,63.32 arc-90 28.32,62.94 28.32,62.9 arc-90 27.94,62.52 27.03,62.52 arc90 26.64,62.13 26.64,62.09 arc90 27.03,61.71 27.94,61.71 arc-90 28.32,61.33 28.32,61.28 arc-90 27.94,60.9 27.03,60.9 arc90 26.64,60.52 26.64,59.08 | R2.2 26.67,59.05 26.64,59.08
TPIN_P
  Top 0.254: IC4.P$13 25.64,53.9 26.19,54.45 26.19,57.33 | 26.19,57.33 26.19,63.91 25.15,64.95 21.41,64.95 20.68,65.68 RJ1.RD+ | R3.1 25.88,57.02 26.19,57.33
TPOUT_N
  Top 0.254: R5.2 17.68,59.33 | 17.68,59.33 17.68,66.9 16.84,67.74 16.84,69.77 17.14,70.08 19.13,70.08 19.41,69.8 RJ1.TD- | 17.68,59.33 17.68,54.27 17.31,53.9 IC4.P$16
TPOUT_P
  Top 0.254: 18.14,57.3 18.14,54.08 17.3,53.25 IC4.P$17 | R4.1 18.14,57.3 | 18.14,57.3 18.14,60.55 arc-90 18.52,60.93 19.8,60.93 arc90 20.18,61.31 20.18,61.32 arc90 19.8,61.7 18.52,61.7 arc-90 18.14,62.08 18.14,62.09 arc-90 18.52,62.48 19.8,62.48 arc90 20.18,62.86 20.18,62.87 arc90 19.8,63.25 18.52,63.25 arc-90 18.14,63.63 RJ1.TD+
TX
  Top 0.305: U$1.15 45.46,50.62 46.23,51.38 51.89,51.38 TP1.TP
TXD
  Top 0.305: U$1.4 43.51,43.26 40.72,40.46 R23.2
USBID  (via drill 0.5 pad 1.27)
  Top 0.305: U$1.11 49.48,47.5 v50.75,48.77
  Bottom 0.305: JP3.ID1 40.98,78.62 44.3,75.31 44.3,62.69 50.75,56.24 v50.75,48.77
VBUS  (via drill 0.5 pad 1.27)
  Top 0.305: U$1.12 48.45,48.15 v49.07,48.77 | IC1.5 39.91,73 39.86,73.05 39.86,73.74 39.45,74.15 C5.+
  Top 0.406: v37.13,76.96 38.41,78.23 43.56,78.23 45.72,76.07 45.72,72.26 | 45.72,72.26 45.72,69.72 | 45.72,69.72 45.72,57.66 v49.07,54.3 | 45.71,72.25 45.72,72.26 | U1.3 45.72,69.72
  Top 0.61: C5.+ v37.13,76.96 C27.1
  Bottom 0.305: v49.07,48.77 v49.07,54.3
  Bottom 0.406: JP3.VBUS1 39.03,78.86 v37.13,76.96
VBUSON  (via drill 0.5 pad 1.27)
  Top 0.305: U$1.22 40.04,49.45 v39.34,50.14
  Top 0.406: R15.2 46.95,58.25 v47.62,57.58
  Bottom 0.305: v39.34,50.14 40.03,49.45 47.04,49.45 47.62,50.04 v47.62,57.58